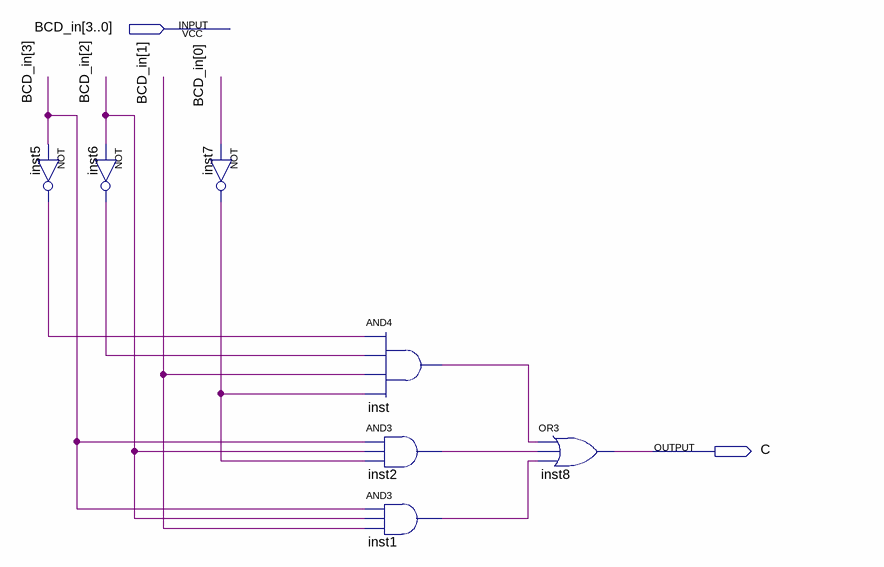
[diagram p0: schematic sheet]
// Quartus schematic BCD_C.bdf as structural Verilog: 7 symbols, 2 pins
module BCD_C (
  input  [3:0] BCD_in,
  output C
);

  wire inst1_out, inst2_out, inst5_out, inst6_out, inst7_out, inst_out;

  not inst5 (inst5_out, BCD_in[3]);
  not inst6 (inst6_out, BCD_in[2]);
  not inst7 (inst7_out, BCD_in[0]);
  and inst (inst_out, inst5_out, inst6_out, BCD_in[1], inst7_out);
  and inst2 (inst2_out, BCD_in[3], BCD_in[2], inst7_out);
  and inst1 (inst1_out, BCD_in[3], BCD_in[2], BCD_in[1]);
  or inst8 (C, inst_out, inst2_out, inst1_out);
endmodule
